# Altium project ADS131A04.PrjPcb
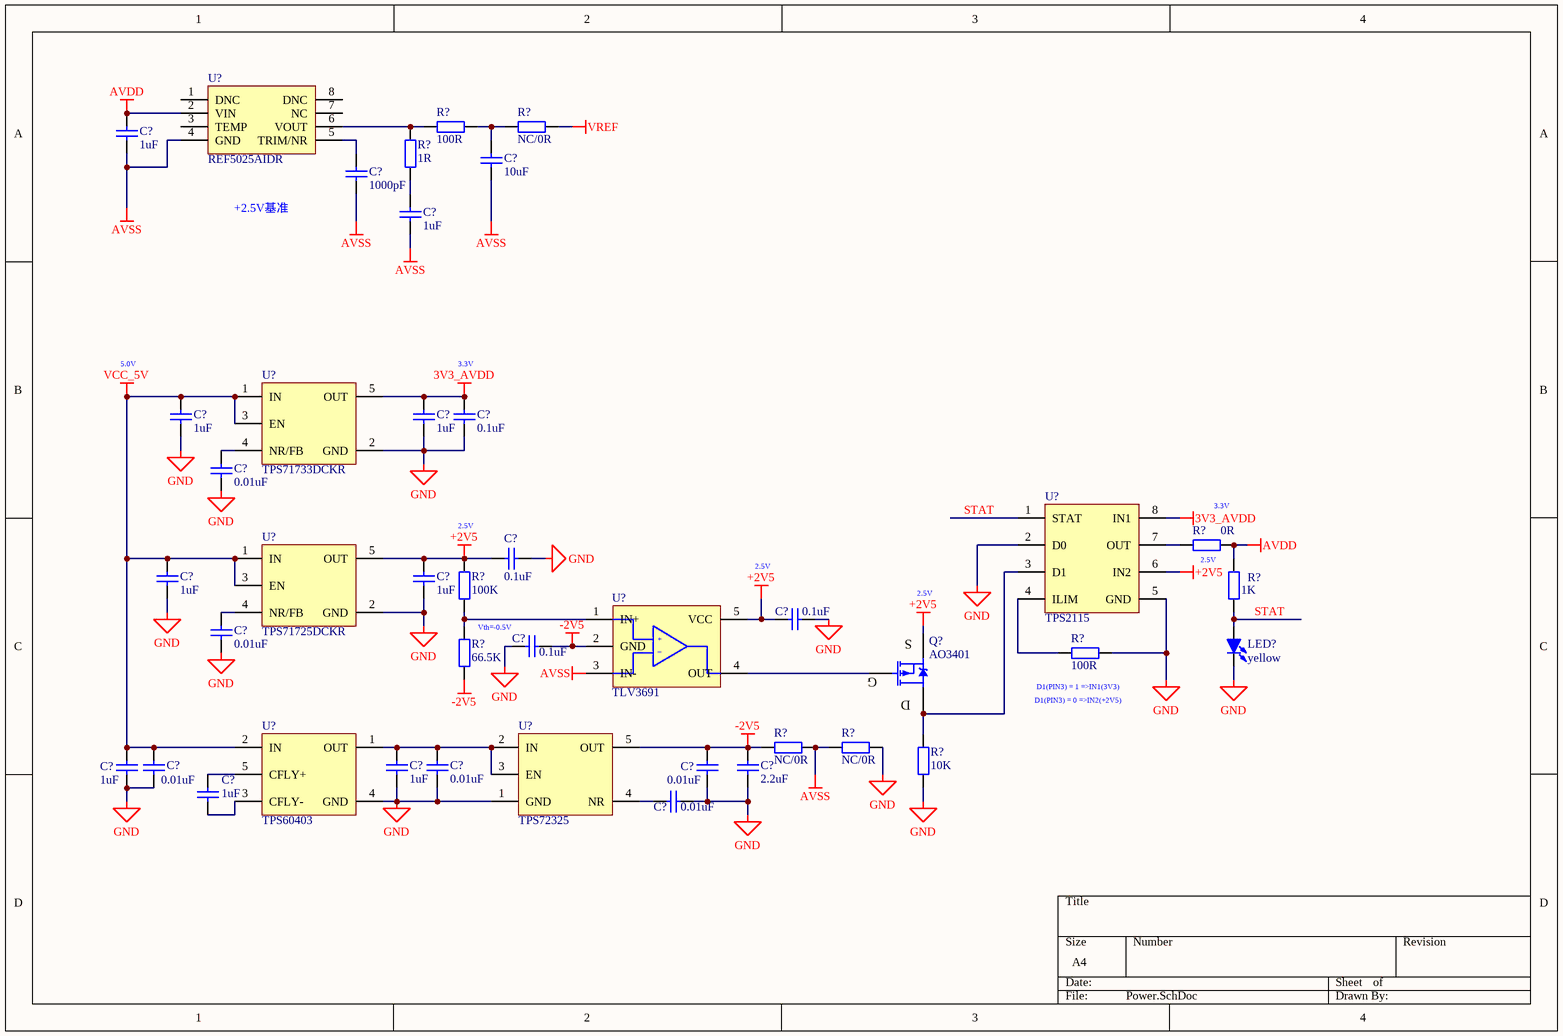
[diagram p0: Power.SchDoc]
2 sheets, 86 parts. Net scope: global (net labels, ports and power ports of the same name join across sheets).
Board files: ADS131A04.PcbDoc, 板框.PcbDoc
Sheets:
  Power.SchDoc
  ADS131A04.SchDoc

## Sheet Power.SchDoc
size A4; SheetNumber: 1; SheetTotal: 3

### Parts
(Parts that share a designator on the sheet are numbered #1, #2 ... from top to bottom, then left to right.)
C?#1  1uF  [C0402_L]
C?#2  10uF  [C0603_L]
C?#3  1000pF  [C0603_L]
C?#4  1uF  [C0402_L]
C?#5  1uF  [C0402_L]
C?#6  1uF  [C0402_L]
C?#7  0.1uF  [C0402_L]
C?#8  0.01uF  [C0402_L]
C?#9  0.1uF  [C0402_L]
C?#10  1uF  [C0402_L]
C?#11  1uF  [C0402_L]
C?#12  0.1uF  [C0402_L]
C?#13  0.01uF  [C0402_L]
C?#14  0.1uF  [C0402_L]
C?#15  1uF  [C0402_L]
C?#16  0.01uF  [C0402_L]
C?#17  1uF  [C0402_L]
C?#18  0.01uF  [C0402_L]
C?#19  0.01uF  [C0402_L]
C?#20  2.2uF  [C0402_L]
C?#21  1uF  [C0402_L]
C?#22  0.01uF  [C0402_L]
LED?  yellow  [LED0402]
Q?  AO3401  [SOT23-3N]
R?#1  100R  [R0402_L]
R?#2  NC/0R  [R0402_L]
R?#3  1R  [R0402_L]
R?#4  0R  [R0402_L]
R?#5  100K  [R0402_L]
R?#6  1K  [R0402_L]
R?#7  100R  [R0402_L]
R?#8  66.5K  [R0402_L]
R?#9  NC/0R  [R0402_L]
R?#10  NC/0R  [R0402_L]
R?#11  10K  [R0402_L]
U?#1  REF5025AIDR  [SOIC-8L]
U?#2  TPS71733DCKR  [SC70-5]
U?#3  TPS2115  [TSSOP-8]
U?#4  TPS71725DCKR  [SC70-5]
U?#5  TLV3691  [SC70-5]
U?#6  TPS60403  [SOT23-5L]
U?#7  TPS72325  [SOT23-5L]

### Nets
3V3_AVDD: C?#6.2 C?#7.2 U?#2.5(OUT) U?#3.8(IN1)
+2V5: C?#9.1 C?#11.2 C?#12.2 Q?.2(S) R?#5.2 U?#3.6(IN2) U?#4.5(OUT) U?#5.5(VCC)
-2V5: C?#14.1 C?#19.2 C?#20.2 R?#8.1 R?#9.1 U?#5.2(GND) U?#7.5(OUT)
AVDD: C?#1.2 R?#4.1 R?#6.2 U?#1.2(VIN)
AVSS: C?#1.1 C?#2.1 C?#3.1 C?#4.1 R?#9.2 R?#10.1 U?#1.4(GND) U?#5.3(IN-)
GND: C?#5.1 C?#6.1 C?#7.1 C?#8.1 C?#9.2 C?#10.1 C?#11.1 C?#12.1 C?#13.1 C?#14.2 C?#15.1 C?#16.1 C?#17.1 C?#18.1 C?#19.1 C?#20.1 C?#22.1 LED?.2(K) R?#7.2 R?#10.2 R?#11.1 U?#2.2(GND) U?#3.2(D0) U?#3.5(GND) U?#4.2(GND) U?#6.4(GND) U?#7.1(GND)
VCC_5V: C?#5.2 C?#10.2 C?#15.2 C?#16.2 U?#2.1(IN) U?#2.3(EN) U?#4.1(IN) U?#4.3(EN) U?#6.2(IN)
VREF: R?#2.2
STAT: LED?.1(A) R?#6.1 U?#3.1(STAT)
NetC?#2_2: C?#2.2 R?#1.2 R?#2.1
NetC?#3_2: C?#3.2 U?#1.5(TRIM/NR)
NetC?#4_2: C?#4.2 R?#3.1
NetC?#8_2: C?#8.2 U?#2.4(NR/FB)
NetC?#13_2: C?#13.2 U?#4.4(NR/FB)
NetC?#17_2: C?#17.2 C?#18.2 U?#6.1(OUT) U?#7.2(IN) U?#7.3(EN)
NetC?#21_1: C?#21.1 U?#6.3(CFLY-)
NetC?#21_2: C?#21.2 U?#6.5(CFLY+)
NetC?#22_2: C?#22.2 U?#7.4(NR)
NetQ?_1: Q?.1(G) U?#5.4(OUT)
NetQ?_3: Q?.3(D) R?#11.2 U?#3.3(D1)
NetR?#1_1: R?#1.1 R?#3.2 U?#1.6(VOUT)
NetR?#4_2: R?#4.2 U?#3.7(OUT)
NetR?#5_1: R?#5.1 R?#8.2 U?#5.1(IN+)
NetR?#7_1: R?#7.1 U?#3.4(ILIM)

Not connected (* = marked no-connect by the designer): U?#1 1(DNC) 3(TEMP) 7(NC) 8(DNC)

### Notes on the sheet
- +2.5V基准
- 5.0V
- (near C?#7) 3.3V
- (near R?#4) 3.3V
- 2.5V
- (near R?#4) 2.5V
- Vth=-0.5V
- (near R?#7) D1(PIN3) = 1 =>IN1(3V3)
- (near R?#7) D1(PIN3) = 0 =>IN2(+2V5)
- (in symbol TLV3691) +; _

### Library data of the parts
C?#1-C?#22 = C: 贴片电容; BOM名称: 无极性贴片电容; 联系卖家，免费查找封装: 唯一出售店铺网址https://shop463601444.taobao.com
LED? = LED-SMD: 贴片LED; 联系卖家 免费查找封装: 封装库来自淘宝卖家ID：黄晶宝石; BOM名称: 贴片LED
Q? = AO3401: P沟道 30V/4.2A; BOM名称: 场效应管; 联系卖家，免费查找封装: 唯一出售店铺网址https://shop463601444.taobao.com; 参数: P沟道 30V/4.2A
R?#1-R?#11 = R: 贴片电阻; 联系卖家，免费查找封装: 唯一出售店铺网址https://shop463601444.taobao.com; BOM名称: 贴片电阻
U?#1 = REF5025AIDR: 3uVpp/V噪声 3ppm/℃漂移 电压基准 0.05%
U?#2 U?#4 = TPS717xx
U?#3 = TPS2115: 2.8~5.5V 84mR 1.25A 电源多路复用器
U?#5 = TLV3691: 毫微功耗比较器
U?#6 = TPS6040x: 非稳压60mA电荷泵电压逆变器
U?#7 = TPS723xx

## Sheet ADS131A04.SchDoc
size A4; SheetNumber: 2; SheetTotal: 2
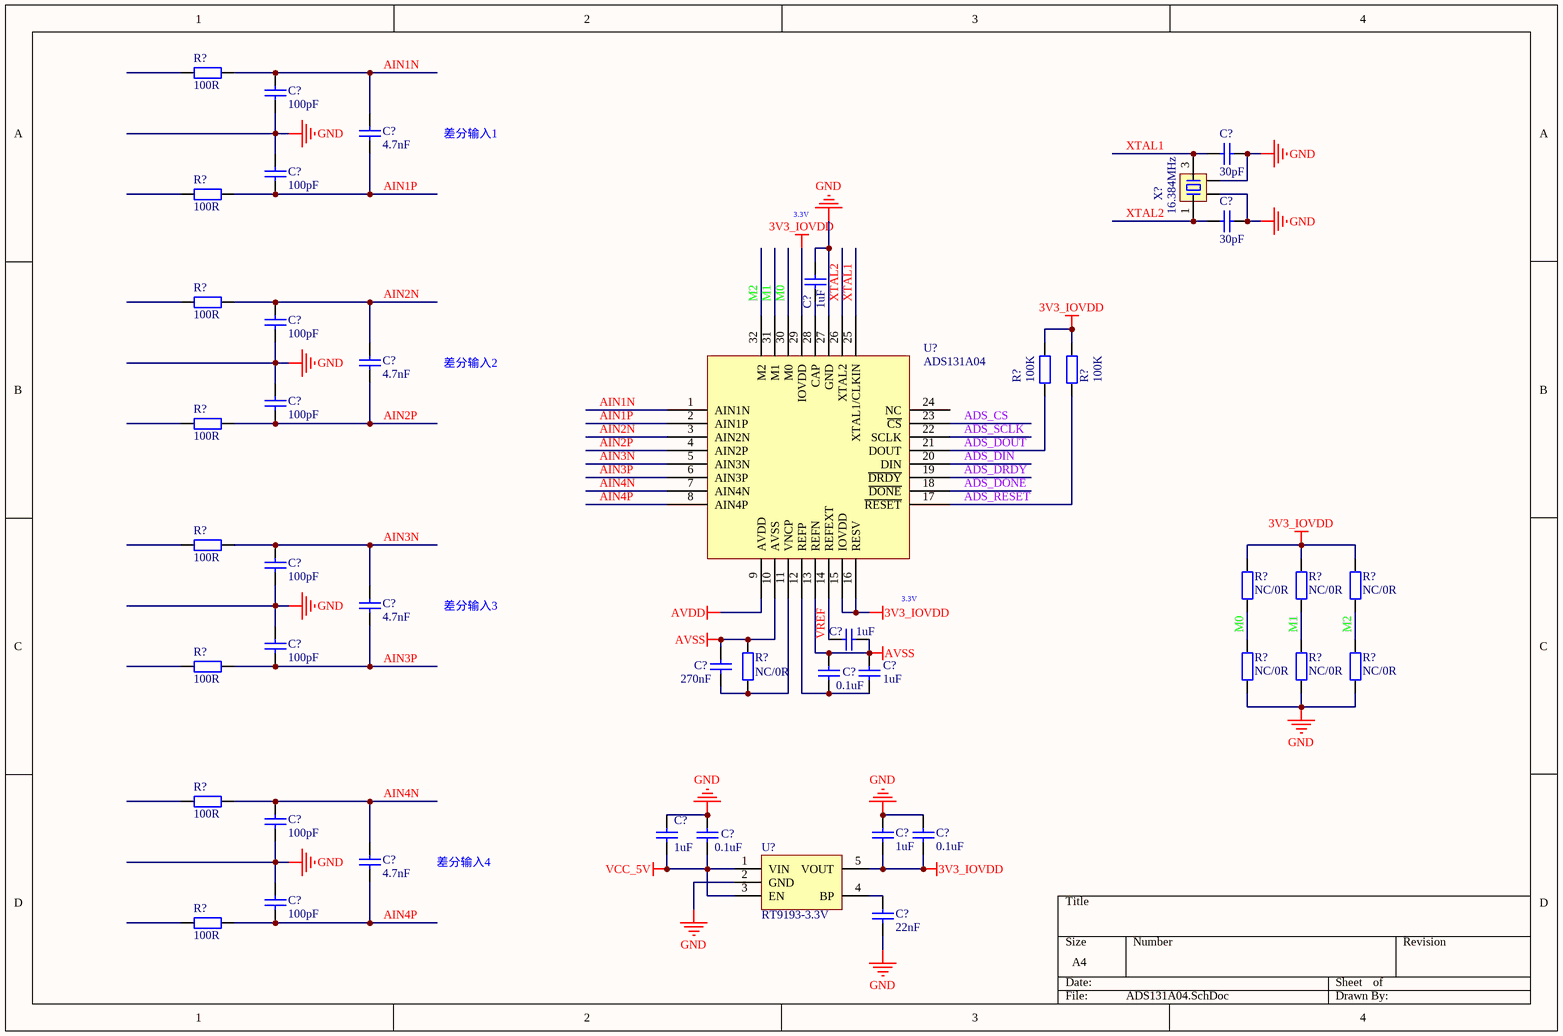
[diagram p1: ADS131A04.SchDoc]

### Parts
(Parts that share a designator on the sheet are numbered #1, #2 ... from top to bottom, then left to right.)
C?#23  100pF  [C0402_L]
C?#24  4.7nF  [C0603_L]
C?#25  30pF  [C0402_L]
C?#26  100pF  [C0402_L]
C?#27  30pF  [C0402_L]
C?#28  1uF  [C0402_L]
C?#29  100pF  [C0402_L]
C?#30  4.7nF  [C0603_L]
C?#31  100pF  [C0402_L]
C?#32  100pF  [C0402_L]
C?#33  4.7nF  [C0603_L]
C?#34  1uF  [C0402_L]
C?#35  100pF  [C0402_L]
C?#36  270nF  [C0402_L]
C?#37  0.1uF  [C0402_L]
C?#38  1uF  [C0402_L]
C?#39  100pF  [C0402_L]
C?#40  1uF  [C0402_L]
C?#41  0.1uF  [C0402_L]
C?#42  1uF  [C0402_L]
C?#43  0.1uF  [C0402_L]
C?#44  4.7nF  [C0603_L]
C?#45  100pF  [C0402_L]
C?#46  22nF  [C0402_L]
R?#12  100R  [R0402_L]
R?#13  100R  [R0402_L]
R?#14  100R  [R0402_L]
R?#15  100K  [R0402_L]
R?#16  100K  [R0402_L]
R?#17  100R  [R0402_L]
R?#18  100R  [R0402_L]
R?#19  NC/0R  [R0402_L]
R?#20  NC/0R  [R0402_L]
R?#21  NC/0R  [R0402_L]
R?#22  100R  [R0402_L]
R?#23  NC/0R  [R0402_L]
R?#24  NC/0R  [R0402_L]
R?#25  NC/0R  [R0402_L]
R?#26  NC/0R  [R0402_L]
R?#27  100R  [R0402_L]
R?#28  100R  [R0402_L]
U?#8  ADS131A04  [TQFP32 5x5_L]
U?#9  RT9193-3.3V  [SOT23-5L]
X?  16.384MHz  [XTAL-3225-4P]

### Nets
3V3_IOVDD: C?#42.1 C?#43.1 R?#15.2 R?#16.2 R?#19.2 R?#20.2 R?#21.2 U?#8.15(IOVDD) U?#8.16(RESV) U?#8.29(IOVDD) U?#9.5(VOUT)
AVDD: U?#8.9(AVDD)
AVSS: C?#34.2 C?#36.2 C?#37.2 C?#38.2 R?#23.2 U?#8.10(AVSS) U?#8.13(REFN)
GND: C?#23.1 C?#25.2 C?#26.2 C?#27.2 C?#28.2 C?#29.1 C?#31.2 C?#32.1 C?#35.2 C?#39.1 C?#40.2 C?#41.2 C?#42.2 C?#43.2 C?#45.2 C?#46.1 R?#24.1 R?#25.1 R?#26.1 U?#8.27(GND) U?#9.2(GND) X?.2 X?.4
VCC_5V: C?#40.1 C?#41.1 U?#9.1(VIN) U?#9.3(EN)
VREF: C?#34.1 U?#8.14(REFEXT)
ADS_CS: U?#8.23(~{CS})
ADS_DIN: U?#8.20(DIN)
ADS_DONE: U?#8.18(~{DONE})
ADS_DOUT: R?#15.1 U?#8.21(DOUT)
ADS_DRDY: U?#8.19(~{DRDY})
ADS_RESET: R?#16.1 U?#8.17(~{RESET})
ADS_SCLK: U?#8.22(SCLK)
AIN1N: C?#23.2 C?#24.2 R?#12.2 U?#8.1(AIN1N)
AIN1P: C?#24.1 C?#26.1 R?#13.2 U?#8.2(AIN1P)
AIN2N: C?#29.2 C?#30.2 R?#14.2 U?#8.3(AIN2N)
AIN2P: C?#30.1 C?#31.1 R?#17.2 U?#8.4(AIN2P)
AIN3N: C?#32.2 C?#33.2 R?#18.2 U?#8.5(AIN3N)
AIN3P: C?#33.1 C?#35.1 R?#22.2 U?#8.6(AIN3P)
AIN4N: C?#39.2 C?#44.2 R?#27.2 U?#8.7(AIN4N)
AIN4P: C?#44.1 C?#45.1 R?#28.2 U?#8.8(AIN4P)
M0: R?#19.1 R?#24.2 U?#8.30(M0)
M1: R?#20.1 R?#25.2 U?#8.31(M1)
M2: R?#21.1 R?#26.2 U?#8.32(M2)
XTAL1: C?#25.1 U?#8.25(XTAL1/CLKIN) X?.3
XTAL2: C?#27.1 U?#8.26(XTAL2) X?.1
NetC?#28_1: C?#28.1 U?#8.28(CAP)
NetC?#36_1: C?#36.1 R?#23.1 U?#8.11(VNCP)
NetC?#37_1: C?#37.1 C?#38.1 U?#8.12(REFP)
NetC?#46_2: C?#46.2 U?#9.4(BP)

Not connected (* = marked no-connect by the designer): R?#12 1; R?#13 1; R?#14 1; R?#17 1; R?#18 1; R?#22 1; R?#27 1; R?#28 1; U?#8 24(NC)

### Notes on the sheet
- 差分输入1
- 3.3V
- 差分输入2
- 差分输入3
- (near U?#8) 3.3V
- 差分输入4

### Library data of the parts
C?#23-C?#46 = C: as C?#1 on sheet Power
R?#12-R?#28 = R: as R?#1 on sheet Power; BOM名称: 贴片电阻
U?#8 = ADS131A04: 4通道差分24位ADC
U?#9 = RT9193-3.3V: 3.3V_LDO
X? = XTAL-4P: 4脚无源晶振(谐振器）; 联系卖家，免费查找封装: 唯一出售店铺网址https://shop463601444.taobao.com; BOM名称: 4脚无源晶振(谐振器）

## Nets that join several sheets
AVDD: Power (C?#1.2 R?#4.1 R?#6.2 U?#1.2), ADS131A04 (U?#8.9)
AVSS: Power (8 pins), ADS131A04 (7 pins)
GND: Power (27 pins), ADS131A04 (23 pins)
VCC_5V: Power (9 pins), ADS131A04 (C?#40.1 C?#41.1 U?#9.1 U?#9.3)
VREF: Power (R?#2.2), ADS131A04 (C?#34.1 U?#8.14)